# Altium project PCB_Project.PrjPcb
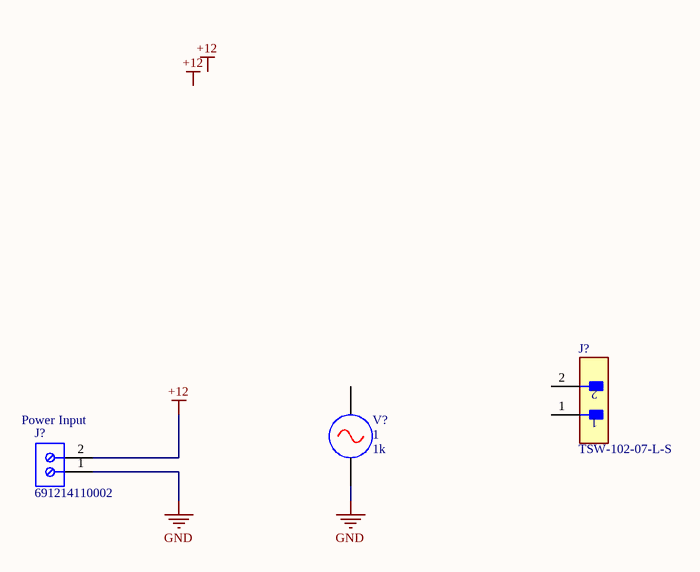
[diagram p0: Sheet1.SchDoc]
1 sheet, 3 parts. Net scope: global (net labels, ports and power ports of the same name join across sheets).

## Sheet Sheet1.SchDoc
size A; SheetNumber: 1; SheetTotal: 1

### Parts
(Parts that share a designator on the sheet are numbered #1, #2 ... from top to bottom, then left to right.)
J?#1  TSW-102-07-L-S  [FP-TSW-102-07-L-S-MFG]
J?#2  691214110002  [691214110002]
V?  Amp: 1  Freq: 1k  (hidden comment: AC Voltage Source)

### Nets
+12: J?#2.2
GND: J?#2.1 V?.2

Not connected (* = marked no-connect by the designer): J?#1 1 2; V? 1

### Notes on the sheet
- (near J?#2) Power Input
- Labels drawn without touching a wire or pin: +12

### Library data of the parts
J?#1 = CMP-02766-001428-1: CONN HEADER VERT 2POS 2.54MM; Voltage Rating: 550V; Current Rating: 7.6A; Gender: Male; Number of Contacts: 2; Connector Type: Male Pin; Radiation Hardening: No; Orientation: Straight; Contact Plating: Gold; Max Operating Temperature: 125°C; Mount: Through Hole; Package Quantity: 1; Number of Rows: 1; Housing Material: Polyester; RoHS Compliant: Yes; Length: 5.08mm; Max Voltage Rating (AC): 550V; Pitch: 2.54mm; Packaging: Bulk; Depth: 2.54mm; Termination: Solder; Min Operating Temperature: -55°C; Housing Color: Black; Lead Free: Lead Free; Color: Black; Number of Positions: 2; Width: 2.54mm; Max Current Rating: 7.6A; REACH SVHC: No SVHC; Contact Material: Bronze; Contact Mating Length: 0.23inch; Series: TSW; Contact Type: Male Pin
J?#2 = CMP-1502-02464-1: Serie 2141 - 3.50 mm Horizontal Entry Modular with Rising Cage Clamp WR-TBL, 2 pin; Manufacturer: Wurth Elektronik; Pin Number: 2; Pitch: 3.50mm; Datasheet URL: http://katalog.we-online.de/em/datasheet/6912141100xx.pdf; Packaging: Box; Mounting Technology: THT; Package Reference: 691214110002; Manufacturer URL: http://www.we-online.de; Part Number: 691214110002; Publisher: WurthElektronik; Operating Temperature: -40to105degC
V? = AC Voltage Source: SimulationGenericComponent: True; DC: 0; Phase: 0; Rser: 0; Cpar: 0